# Altium schematic sheet CON2.SchDoc
size A4
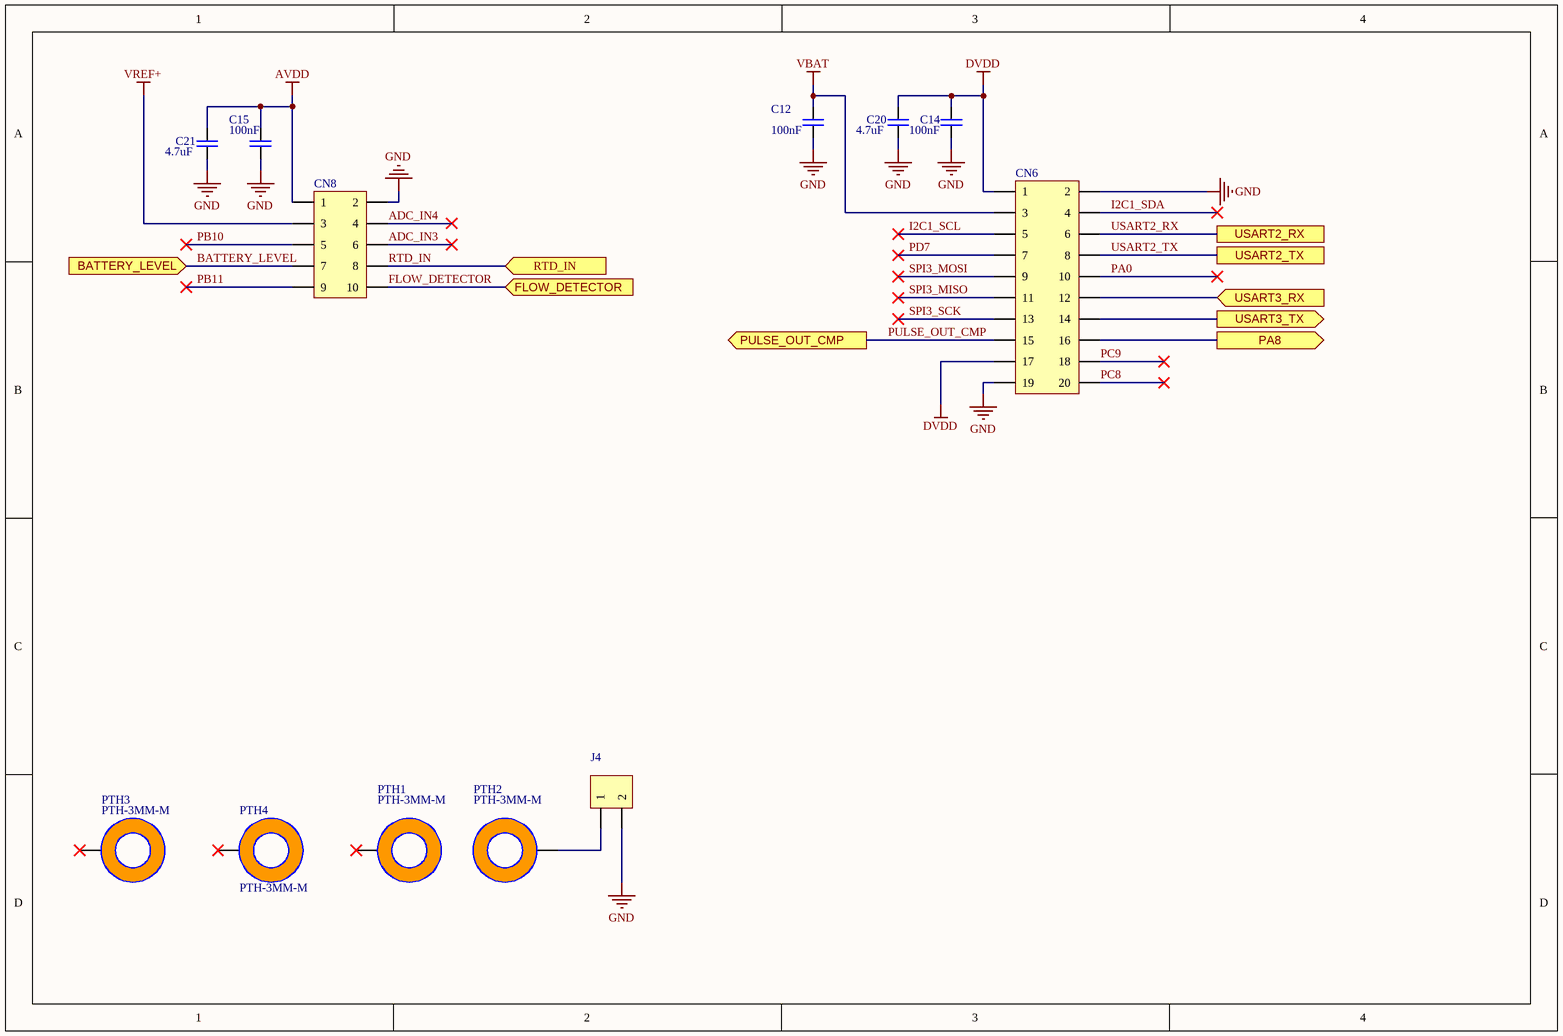
[diagram p0: CON2.SchDoc]

## Parts
C12  100nF  [CAP_SM0805_YAGEOCC2_N]
C14  100nF  [CAP_SM0805_YAGEOCC2_N]
C15  100nF  [CAP_SM0805_YAGEOCC2_N]
C20  4.7uF  [CAP_SM0805_YAGEOCC2_N]
C21  4.7uF  [CAP_SM0805_YAGEOCC2_N]
CN6  DZ254R-22-20-63  [HEADER PIN 2X10]  (value not drawn)
CN8  Uar Equivalente  [HEADER PIN 2X5 MIRROR]  (value not drawn)
J4  Usar Equivalene  [HEADER PIN 1X2]  (value not drawn)
PTH1  PTH-3MM-M  [PTH_M3_M]
PTH2  PTH-3MM-M  [PTH_M3_M]
PTH3  PTH-3MM-M  [PTH_M3_M]
PTH4  PTH-3MM-M  [PTH_M3_M]

## Ports
BATTERY_LEVEL (in), FLOW_DETECTOR (in), PA8 (out), PULSE_OUT_CMP (out), RTD_IN (in), USART2_RX, USART2_TX, USART3_RX (in), USART3_TX (out)

## Nets
AVDD: C15.1 C21.1 CN8.1
DVDD: C14.1 C20.1 CN6.1 CN6.17
GND: C12.2 C14.2 C15.2 C20.2 C21.2 CN6.2 CN6.19 CN8.2 J4.2
VBAT: C12.1 CN6.3
VREF+: CN8.3
ADC_IN3: CN8.6
ADC_IN4: CN8.4
BATTERY_LEVEL: CN8.7 ; port BATTERY_LEVEL
FLOW_DETECTOR: CN8.10 ; port FLOW_DETECTOR
I2C1_SCL: CN6.5
I2C1_SDA: CN6.4
PA0: CN6.10
PA8: CN6.16 ; port PA8
PB10: CN8.5
PB11: CN8.9
PC8: CN6.20
PC9: CN6.18
PD7: CN6.7
PULSE_OUT_CMP: CN6.15 ; port PULSE_OUT_CMP
RTD_IN: CN8.8 ; port RTD_IN
SPI3_MISO: CN6.11
SPI3_MOSI: CN6.9
SPI3_SCK: CN6.13
USART2_RX: CN6.6 ; port USART2_RX
USART2_TX: CN6.8 ; port USART2_TX
USART3_RX: CN6.12 ; port USART3_RX
USART3_TX: CN6.14 ; port USART3_TX
NetJ4_1: J4.1 PTH2.1

Not connected (* = marked no-connect by the designer): PTH1 1*; PTH3 1*; PTH4 1*

## Library data of the parts
C12 C14 C15 = CC0805KRX7R8BB104: CAP 100nF SM0805 X7R 25V YAGEO CC2; Tolerance (%): 10; Voltage Rating (Volts): 25; Category: Capacitor; Manufacturer: Yageo; Manufacturer Part Number: CC0805KRX7R8BB104; Package: 0805; Value: 100nF; Supplier Part Number 1: 644249; Supplier 1: Farnell; ComponentLink1URL: http://www.yageo.com; ComponentLink1Description: Manufacturer Website; Supplier 2: Digi-Key; Supplier Part Number 2: 311-1141-1-ND
C20 C21 = CC0805KRX5R6BB475: CAP 4.7uF SM0805 X5R 10V YAGEO CC2; Tolerance (%): 10; Category: Capacitor; Manufacturer: Yageo; Manufacturer Part Number: CC0805KRX5R6BB475; Package: 0805; Value: 4.7uF; Supplier Part Number 1: 718671; Supplier 1: Farnell; ComponentLink1URL: http://www.yageo.com; ComponentLink1Description: Manufacturer Website; Voltage Rating (Volts): 10; Supplier 2: Digi-Key; Supplier Part Number 2: 311-1374-1-ND; Datasheet: https://datasheet.lcsc.com/lcsc/2304140030_YAGEO-CC0805KRX5R6BB475_C605218.pdf
CN6 = DZ254R-22-20-63: 2 x 10 - true hole 2.54mm; Manufacturer: DEALON; ComponentLink1Description: Datasheet; ComponentLink1URL: https://datasheet.lcsc.com/lcsc/2201121730_DEALON-DZ254R-22-20-63_C2935926.pdf; Manufacturer Part Number: DZ254R-22-20-63; Category: Header pin
CN8 = DZ254R-22-10-63: 2 x 5 - true hole 2.54mm; Manufacturer: DEALON; Equivalente: PZ254V-12-10P; Category: Header pin; Datasheet: https://datasheet.lcsc.com/lcsc/2201121730_DEALON-DZ254R-22-10-63_C2935920.pdf; Manufacturer Part Number: DZ254R-22-10-63
J4 = 54101-T0602LF: 1 x 2 - true hole  2.54mm - Pb free; Manufacturer: Amphenol ICC; Equivalente: B-2100S02P-A110; Manufacturer Part Number: 54101-T0602LF; Category: Header pin; Datasheet: https://datasheet.lcsc.com/lcsc/2202082130_Amphenol-ICC-54101-T06-00_C213463.pdf
PTH1-PTH4 = PTH-3MM-M: Agujero de montaje metalizado roscas M3. Drill de tamaño medio.